# EAGLE design coin12mm - switched (EAGLE 6.3)
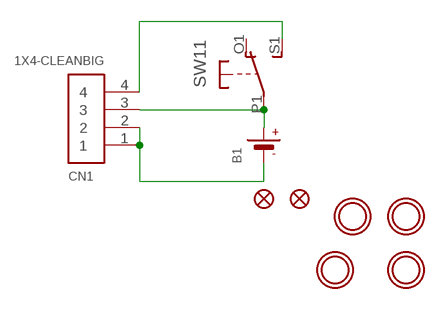
[diagram p0: schematic, sheet 1]

## Parts
B1  BATTERYCR1220_SMT  [CR1220]
CN1  1X4-CLEANBIG  [1X04-CLEANBIG]
FID1  FIDUCIAL""  [FIDUCIAL_1MM]
FID2  FIDUCIAL""  [FIDUCIAL_1MM]
SW1  DPDT-EG1390  [EG1390]
U$1  MOUNTINGHOLE2.5  [MOUNTINGHOLE_2.5_PLATED]
U$2  MOUNTINGHOLE2.5  [MOUNTINGHOLE_2.5_PLATED]
U$3  MOUNTINGHOLE2.5  [MOUNTINGHOLE_2.5_PLATED]
U$5  MOUNTINGHOLE2.5  [MOUNTINGHOLE_2.5_PLATED]

## Nets
3V: B1.+$1(+) CN1.3 SW1.P1(1:P)
N$2: B1.- CN1.1 CN1.2
N$3: CN1.4 SW1.S1(1:S)
Unconnected: SW1.O1(1:O) SW1.O2(2:O) SW1.P2(2:P) SW1.S2(2:S)

## Library data of the parts
B1 = microbuilder:BATTERY: CR1220 SMT - Digikey: 3001K-ND CD2032 BAT-HLD-001 - Digikey: BAT-HLD-001-ND
CN1 = adafruit2:1X4: 4-pin connector
FID1 FID2 = microbuilder:FIDUCIAL: Fiducial Alignment Points Various fiducial points for machine vision alignment.; BOM: EXCLUDE
SW1 = adafruit:DPDT
U$1-U$3 U$5 = microbuilder:MOUNTINGHOLE: Mounting Hole For #2 screws (0.086"/2.18mm width, 0.094"/2.4mm hole) use 2.5mm; BOM: EXCLUDE

## Board
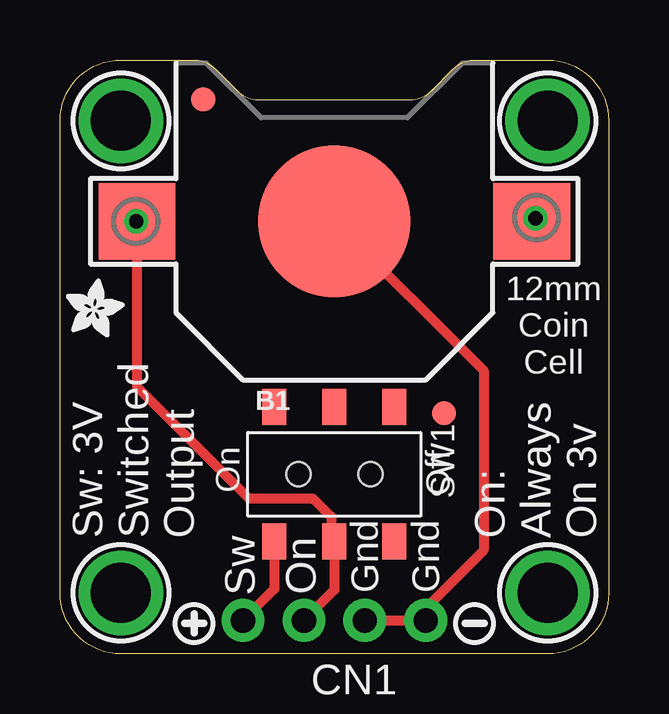
[diagram p1: board, top side]
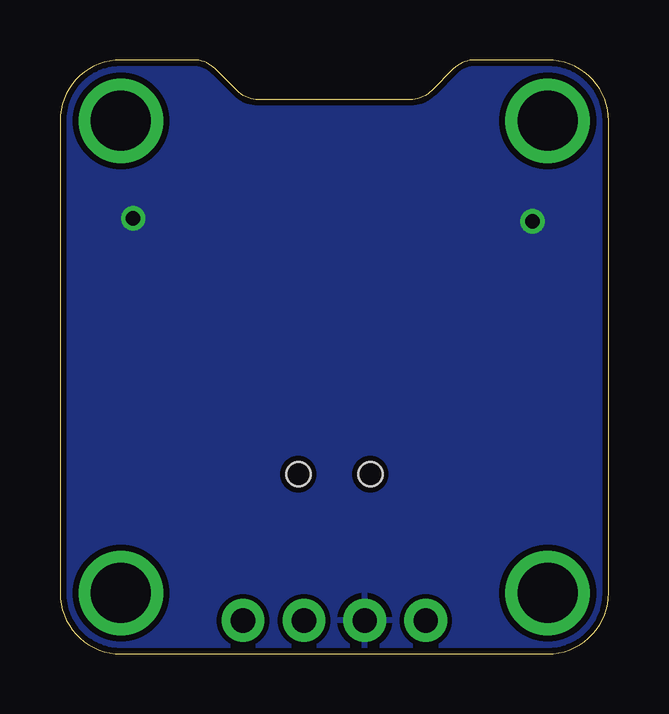
[diagram p2: board, bottom side, seen from below]

Size 22.86 x 24.77 mm. Coordinates in mm from the lower left corner, seen from the top.
Outline: 2.54,24.77 5.57,24.77 arc-45 6.47,24.39 7.38,23.49 arc45 8.27,23.11 14.59,23.11 arc45 15.48,23.49 16.39,24.39 arc-45 17.29,24.77 20.32,24.77 arc-90 22.86,22.23 22.86,2.54 arc-90 20.32,0 2.54,0 arc-90 0,2.54 0,22.23 arc-90 2.54,24.77
Copper layers (1*16): Top 0.035mm / dielectric 1.5mm / Bottom 0.035mm
Design rules "adafruit": minimum track width 8mil, minimum drill 15.5mil, track to track 8mil, track to pad 8mil, pad to pad 8mil, via to via 8mil, smd to smd 8mil, copper to edge 10mil, drill to drill 8mil, minimum pad ring 10mil, minimum via ring 8mil, stop-mask expansion 2mil, vias tented up to drill 20mil, thermal gap 10mil

### Footprints (pad centres in the part's own frame; a part is rotated, then mirrored left to right if it is on the bottom)
CR1220 = smd 3.2 x 3.2: +$1 -8.225,0; +$2 8.225,0 | smd 6.35 x 6.35: - 0,0
1X04-CLEANBIG = drill 1.016 pad 1.778: 1 -3.81,0; 2 -1.27,0; 3 1.27,0; 4 3.81,0
FIDUCIAL_1MM = smd 1 x 1: 1 0,0
EG1390 = smd 1 x 1.5: O1 -2.5,2.8; O2 -2.5,-2.8; P1 0,2.8; P2 0,-2.8; S1 2.5,2.8; S2 2.5,-2.8 | hole 1: 1.5,0; -1.5,0
MOUNTINGHOLE_2.5_PLATED = drill 2.5 pad 3.2: P$1 0,0

### Placement (x,y rotation side)
B1  11.43,18.03 0 top
CN1  11.43,1.4 180 top
FID1  5.97,23.11 0 top
FID2  16,10.03 0 top
SW1  11.43,7.49 180 top
U$1  2.54,22.23 0 top
U$2  20.32,22.23 0 top
U$3  2.54,2.54 0 top
U$5  20.32,2.54 0 top
U$6  [SYMBOL_PLUS]  5.59,1.27 0 top
U$7  [SYMBOL_MINUS]  17.27,1.27 0 top
U$8  [ADAFRUIT_2.5MM]  0.25,13.21 0 top

### Tracks (layer width: path | path; a pad name or v marks a point on that pad's centre or on a via)
3V  (via drill 0.6)
  Top 0.406: CN1.3 11.43,2.67 SW1.P1 11.3,4.82 11.3,5.71 10.54,6.48 7.87,6.48 3.21,11.15 B1.+$1
  other vias: 3.17,18.03 19.81,18.16
  pour Bottom: 0,25.02 0,-0.13 22.86,-0.13 22.86,25.02
N$2
  Top 0.406: CN1.2 CN1.1 15.24,1.91 17.65,4.32 17.65,11.81 B1.-
N$3
  Top 0.406: SW1.S1 8.93,2.71 CN1.4

### Text on the board
tPlace: 12mm / Coin / Cell | On | Off | Sw: 3V / Switched / Output | On: / Always / On 3v | Sw | On | Gnd | Gnd